# Altium schematic sheet Display.SchDoc: AC POWER METER
size 420 x 297 mm; DrawnBy: Truong Giang; DocumentNumber: Learning; SheetNumber: 6; SheetTotal: 6
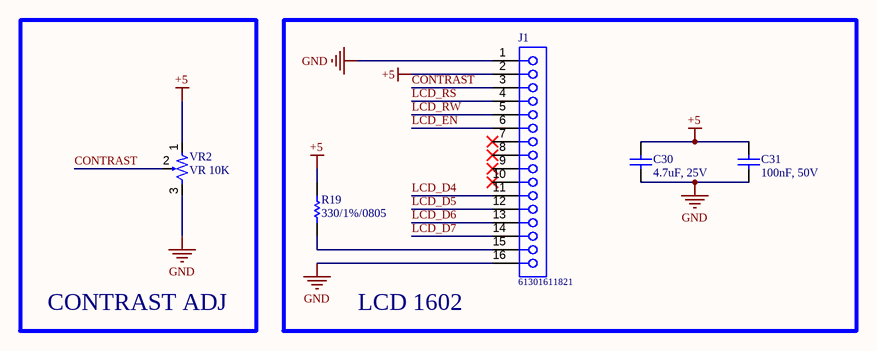
[diagram p0: Display.SchDoc]

## Parts
C30  4.7uF, 25V  [WCAP-CSGP_0805_H=1.25mm]
C31  100nF, 50V  [WCAP-CSGP_0805_H=0.8mm_Wave]
J1  61301611821  [61301611821]
R19  value 330/1%/0805  [RES-SM-0805]  (hidden comment: RESISTOR SMD)
VR2  value VR 10K  [VARISTOR 2]  (hidden comment: 10K)

## Blocks framed on the sheet
CONTRAST ADJ: VR2
LCD 1602: C30 C31 J1 R19

## Nets
+5: C30.2 C31.2 J1.2 R19.2 VR2.1
GND: C30.1 C31.1 J1.1 J1.16 VR2.3
CONTRAST: J1.3 VR2.2
LCD_D4: J1.11
LCD_D5: J1.12
LCD_D6: J1.13
LCD_D7: J1.14
LCD_EN: J1.6
LCD_RS: J1.4
LCD_RW: J1.5
NetJ1_15: J1.15 R19.1

Not connected (* = marked no-connect by the designer): J1 7* 8* 9* 10*

## Notes on the sheet
- PROJECT
- TITLE
- DRAWN BY
- SIZE
- FILE NAME
- SHEET
- OF
- A3

## Library data of the parts
C30 = 885012107018: WCAP-CSGP Multilayer Ceramic Chip Capacitor, General Purpose, size 0805, X5R, 4.7uF, 25V; Manufacturer: Wurth Elektronik; Rated Voltage: 25VDC; Isolation Resistance: >=0.02GOhm; Capacitance Tolerance: +/-20%; Technical Reference: X5R0805475M025DFCT10000; ComponentLink1Description: Manufacturer; ComponentLink1URL: http://www.we-online.de; ComponentLink2Description: Datasheet; ComponentLink2URL: https://www.we-online.com/catalog/datasheet/885012107018.pdf; Operating Temperature: -55 to +85degC; Packaging: Tape and Reel; Manufacturer Part Number: 885012107018; Published Date: May 2020; Ceramic Type: X5R; Dissipation Factor: =<10%; Height: 1.25mm; Mounting Technology: SMT; Size: 0805; Capacitance: 4.7uF
C31 = 885012207098: WCAP-CSGP Multilayer Ceramic Chip Capacitor, General Purpose, size 0805, X7R, 100nF, 50V; Manufacturer: Wurth Elektronik; Rated Voltage: 50VDC; Isolation Resistance: >=5GOhm; Capacitance Tolerance: +/-10%; Technical Reference: X7R0805104K050DFCT10000; ComponentLink1Description: Manufacturer; ComponentLink1URL: http://www.we-online.de; ComponentLink2Description: Datasheet; ComponentLink2URL: https://www.we-online.com/catalog/datasheet/885012207098.pdf; Operating Temperature: -55 to +125degC; Packaging: Tape and Reel; Manufacturer Part Number: 885012207098; Published Date: May 2020; Ceramic Type: X7R; Dissipation Factor: =<2.5%; Height: 0.8mm; Mounting Technology: SMT; Size: 0805; Capacitance: 100nF
J1 = 61301611821: WR-PHD Socket Header, THT, pitch 2.54mm, Single Row, Vertical, 16p; Manufacturer: Wurth Elektronik; Pin Number: 16; Rated Current: 3A; Working Voltage: 250VAC; Withstanding Voltage: 500VAC; Contact Resistance: 20mOhm; ComponentLink1Description: Manufacturer; ComponentLink1URL: http://www.we-online.de; ComponentLink2Description: Datasheet; ComponentLink2URL: https://www.we-online.com/catalog/datasheet/61301611821.pdf; Manufacturer Part Number: 61301611821; Published Date: May 2020; Pitch: 2.54mm; Operating Temperature: -40 to +125degC; Mounting Technology: THT; Packaging: Tray; Gender: Socket Header; Row Number: Single; Orientation: Vertical
R19 = RESISTOR SMD: Resistor
VR2 = Var Resistor